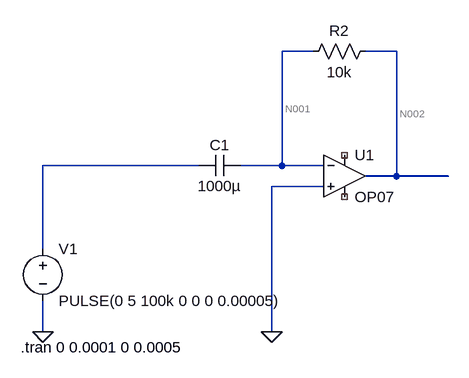
[diagram p0: schematic Differentiator using Op-Amp.asc]
Differentiator using Op-Amp.asc, the LTspice schematic file:
Version 4
SHEET 1 880 680
WIRE 224 -16 176 -16
WIRE 352 -16 304 -16
WIRE 48 160 -192 160
WIRE 176 160 176 -16
WIRE 176 160 112 160
WIRE 240 160 176 160
WIRE 352 176 352 -16
WIRE 352 176 304 176
WIRE 432 176 352 176
WIRE 240 192 160 192
WIRE -192 288 -192 160
WIRE -192 416 -192 368
WIRE 160 416 160 192
FLAG -192 416 0
FLAG 160 416 0
SYMBOL OpAmps\\OP07 272 112 R0
SYMATTR InstName U1
SYMBOL res 320 -32 R90
WINDOW 0 0 56 VBottom 2
WINDOW 3 32 56 VTop 2
SYMATTR InstName R2
SYMATTR Value 10k
SYMBOL cap 112 144 R90
WINDOW 0 0 32 VBottom 2
WINDOW 3 32 32 VTop 2
SYMATTR InstName C1
SYMATTR Value 1000µ
SYMBOL voltage -192 272 R0
WINDOW 123 0 0 Left 0
WINDOW 39 0 0 Left 0
SYMATTR InstName V1
SYMATTR Value PULSE(0 5 100k 0 0 0 0.00005)
TEXT -226 440 Left 2 !.tran 0 0.0001 0 0.0005

The netlist it stands for:
* Differentiator using Op-Amp.asc
XU1 0 N001 NC_01 NC_02 N002 LT1001  ; OP07, pins In+ In- V+ V- OUT
R2 N002 N001 10k
C1 N001 N003 1000µ
V1 N003 0 PULSE(0 5 100k 0 0 0 0.00005)
.tran 0 0.0001 0 0.0005
.lib LTC.lib
.backanno
.end

* Results of the author's LTspice run, read from the files saved beside the schematic
* Operating Point, zero values left out:
*   V(n001) = 1.016 V
*   V(n002) = 1.017 V
*   I(R2) = 126.8 nA
*   Ix(u1:1) = -126.8 nA
*   Ix(u1:2) = 126.8 nA
*   Ix(u1:5) = -126.8 nA